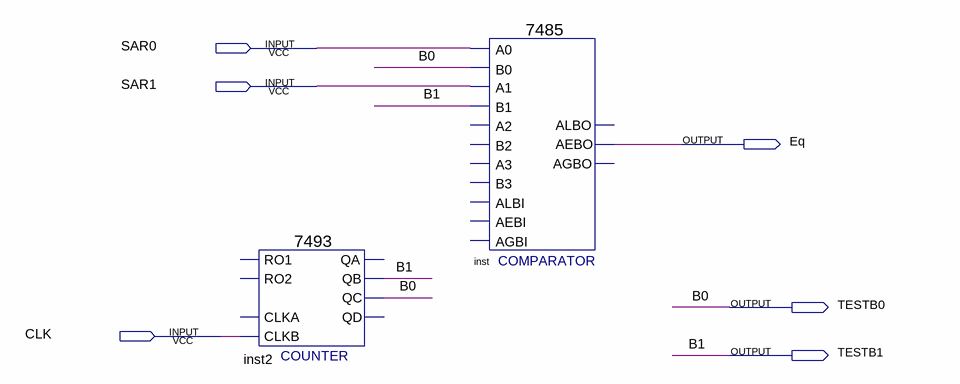
[diagram p0: schematic sheet]
// Quartus schematic Block2.bdf as structural Verilog: 2 symbols, 6 pins
module Block2 (
  input  SAR0,
  input  SAR1,
  input  CLK,
  output Eq,
  output TESTB0,
  output TESTB1
);

  \7493  inst2 (.CLKB(CLK), .QC(TESTB0), .QB(TESTB1));  // open: RO1, RO2, CLKA, QA, QD
  \7485  inst (
    .A0(SAR0), .B0(TESTB0), .A1(SAR1), .B1(TESTB1), .AEBO(Eq));  // open: A3, B2, A2, AEBI, AGBI, ALBI, B3, ALBO, AGBO

  // Other names for the same wires on the sheet: B0 = TESTB0; B1 = TESTB1
endmodule
